# Altium schematic sheet [02] - BLOCK DIAGRAM.SchDoc
size A3; DocumentNumber: 2; SheetNumber: 2; SheetTotal: 4
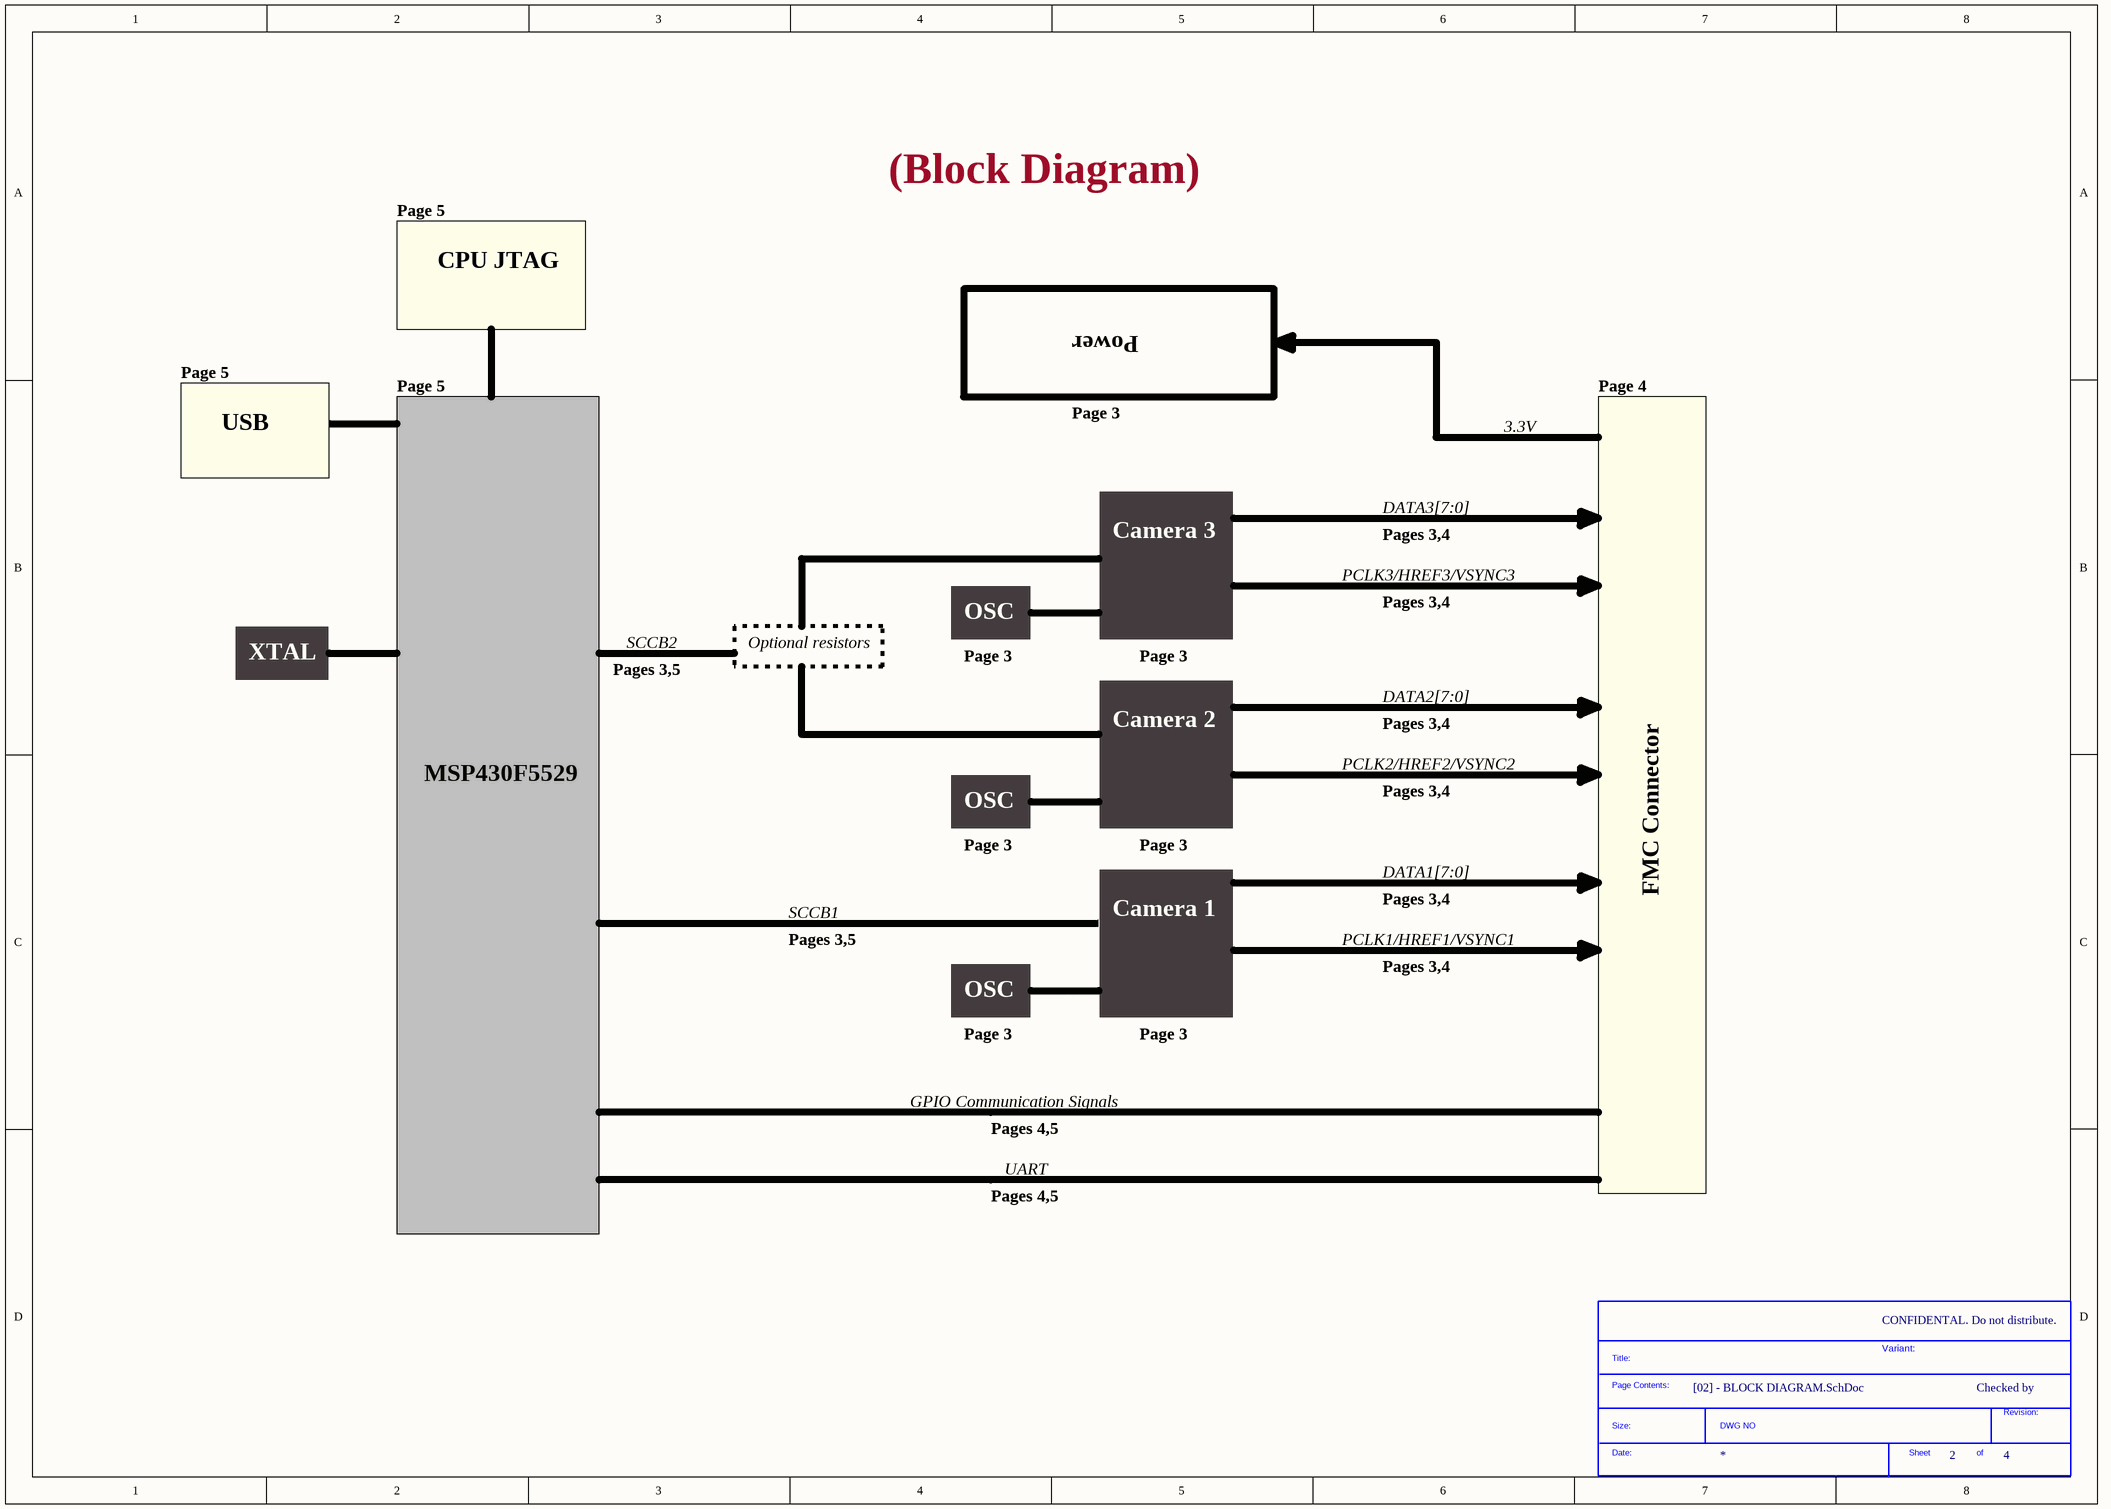
[diagram p0: [02] - BLOCK DIAGRAM.SchDoc]

## Parts
*  SDTitleBlock  (value not drawn)  (graphical)

## Notes on the sheet
- Page 5
- (Block Diagram)
- CPU JTAG
- Power
- USB
- Page 3
- 3.3V
- Page 4
- DATA3[7:0]
- Camera 3
- PCLK3/HREF3/VSYNC3
- Pages 3,4
- SCCB2
- Optional resistors
- FPGA
- OSC
- ETHERNET
- XTAL
- Pages 3,5
- DATA2[7:0]
- MSP430F5529
- Camera 2
- PCLK2/HREF2/VSYNC2
- SCCB1
- CLOCKS (CPU & PCIE)
- Camera 1
- DATA1[7:0]
- FMC Connector
- PCLK1/HREF1/VSYNC1
- GPIO Communication Signals
- Pages 4,5
- UART
- CONFIDENTAL. Do not distribute.
- Variant:
- Checked by
- (in symbol SDTitleBlock) Title:; Page Contents:; Revision:; Size:; DWG NO; Date:; Sheet; of